# EAGLE design ArduinoRFM95 V6 (EAGLE 7.7.0)
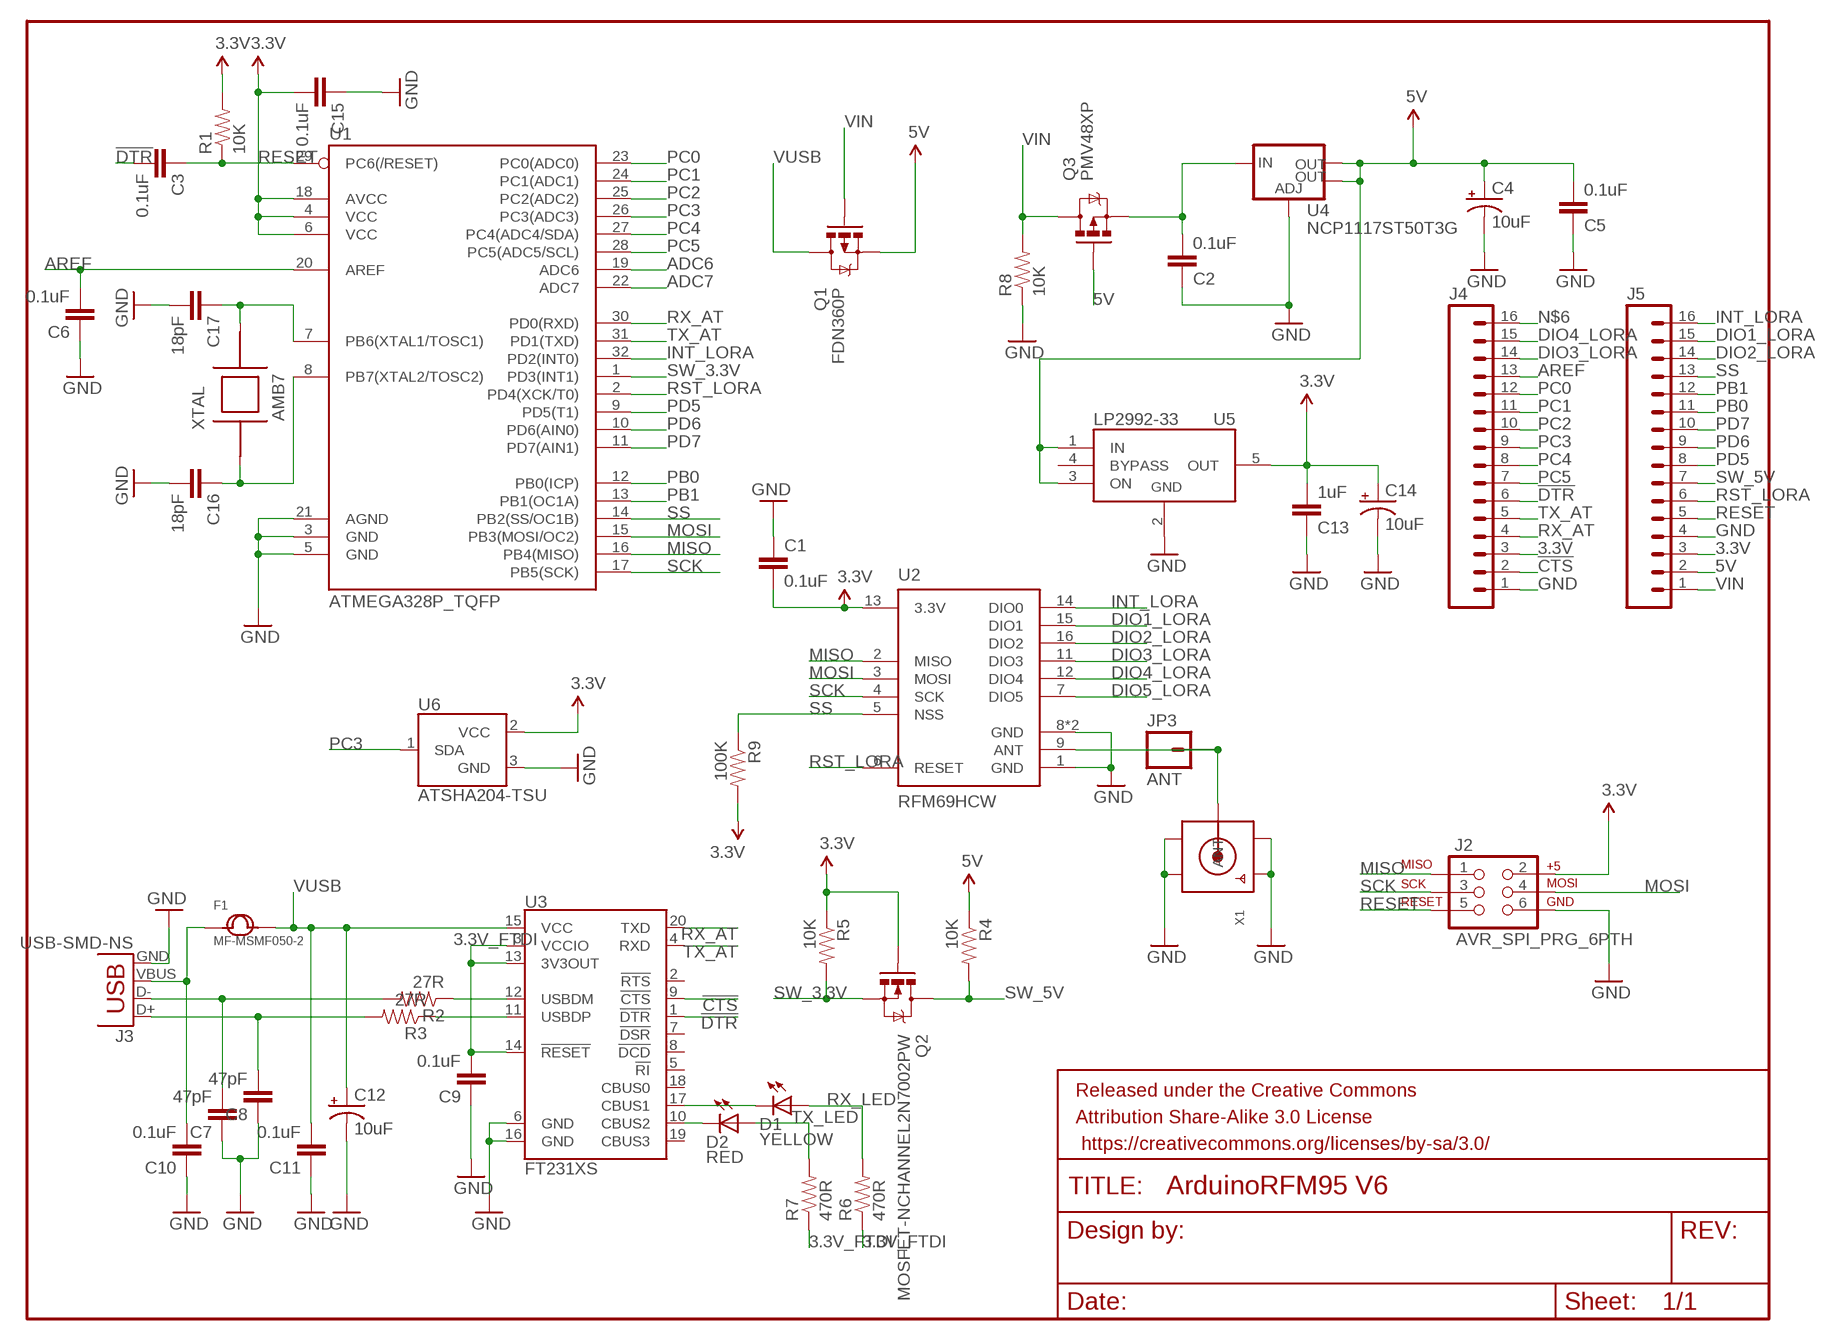
[diagram p0: schematic, sheet 1]

## Parts
C1  0.1uF  CAP0603-CAP  [0603-CAP]
C2  0.1uF  CAP0603-CAP  [0603-CAP]
C3  0.1uF  CAP0603-CAP  [0603-CAP]
C4  10uF  CAP_POL3528-KIT  [EIA3528-KIT]
C5  0.1uF  CAP0603-CAP  [0603-CAP]
C6  0.1uF  CAP0603-CAP  [0603-CAP]
C7  47pF  CAP0603-CAP  [0603-CAP]
C8  47pF  CAP0603-CAP  [0603-CAP]
C9  0.1uF  CAP0603-CAP  [0603-CAP]
C10  0.1uF  CAP0603-CAP  [0603-CAP]
C11  0.1uF  CAP0603-CAP  [0603-CAP]
C12  10uF  CAP_POL3528-KIT  [EIA3528-KIT]
C13  1uF  CAP0603-CAP  [0603-CAP]
C14  10uF  CAP_POL3528-KIT  [EIA3528-KIT]
C15  0.1uF  CAP0603-CAP  [0603-CAP]
C16  18pF  CAP0603-CAP  [0603-CAP]
C17  18pF  CAP0603-CAP  [0603-CAP]
D1  YELLOW  LEDCHIP-LED0603  [CHIP-LED0603]
D2  RED  LEDCHIP-LED0603  [CHIP-LED0603]
F1  MF-MSMF050-2  SMD-PPTC-USE-PPTC-0.50A-15V-0.15OHM(1812)  [F1812]
FRAME1  FRAME-LETTER  [CREATIVE_COMMONS]
J2  AVR_SPI_PRG_6PTH  [2X3]
J3  USB-SMD-NS  [USB-MINIB-NOSTOP]
J4  M161X16_NO_SILK  [1X16_NO_SILK]
J5  M161X16_NO_SILK  [1X16_NO_SILK]
JP3  M01NOSILK-KIT  [1X01NS-KIT]
Q1  FDN360P  MOSFET-PCHANNELSMD  [SOT23-3]
Q2  MOSFET-NCHANNEL2N7002PW  [SOT323]
Q3  PMV48XP  MOSFET-PCHANNELSMD  [SOT23-3]
R1  10K  RESISTOR0603-RES  [0603-RES]
R2  27R  RESISTOR0603-RES  [0603-RES]
R3  27R  RESISTOR0603-RES  [0603-RES]
R4  10K  RESISTOR0603  [0603-RES]
R5  10K  RESISTOR0603-RES  [0603-RES]
R6  470R  RESISTOR0603-RES  [0603-RES]
R7  470R  RESISTOR0603-RES  [0603-RES]
R8  10K  RESISTOR0603-RES  [0603-RES]
R9  100K  RESISTOR0603-RES  [0603-RES]
U1  ATMEGA328P_TQFP  [TQFP32-08]
U2  RFM69HCW  [RFM69HCW-XXXS2]
U3  FT231XS  [SSOP20_L]
U4  NCP1117ST50T3G  V_REG_LM1117SOT223  [SOT223]
U5  LP2992-33  LP2992-3.3  [SOT-23-5]
U6  ATSHA204-TSU  [SOT23-3]
X1  SMACONNECTOR_EDGE_UFL  [SMA_EDGELAUNCH_UFL]
XTAL  AMB7  [2-SMD_ABM7]

## Nets
3.3V: C1.2 C13.2 C14.A(+) C15.2 J2.2 J4.3 J5.3 Q2.1(G) R1.2 R5.1 R9.2 U1.4(VCC) U1.6(VCC) U1.18(AVCC) U2.13(3.3V) U5.5(OUT) U6.2(VCC)
3.3V_FTDI: C9.2 R6.1 R7.1 U3.3(VCCIO) U3.13(3V3OUT) U3.14(!RESET)
5V: C4.A(+) C5.2 J5.2 Q1.2(S) Q3.1(G) R4.1 U4.2(OUT) U4.4(OUT) U5.1(IN) U5.3(ON)
!CTS: J4.2 U3.9(!CTS)
!DTR: C3.2 J4.6 U3.1(!DTR)
ADC6: U1.19(ADC6)
ADC7: U1.22(ADC7)
ANT: JP3.1 U2.9(ANT) X1.P(ANT)
AREF: C6.2 J4.13 U1.20(AREF)
DIO1_LORA: J5.15 U2.15(DIO1)
DIO2_LORA: J5.14 U2.16(DIO2)
DIO3_LORA: J4.14 U2.11(DIO3)
DIO4_LORA: J4.15 U2.12(DIO4)
DIO5_LORA: U2.7(DIO5)
GND: C1.1 C2.1 C4.C(-) C5.1 C6.1 C7.1 C8.1 C9.1 C10.1 C11.1 C12.C(-) C13.1 C14.C(-) C15.1 C16.2 C17.2 J2.6 J3.GND J4.1 J5.4 R8.1 U1.3(GND) U1.5(GND) U1.21(AGND) U2.1(GND) U2.8(GND) U2.10(GND) U3.6(GND) U3.16(GND) U4.1(ADJ) U5.2(GND) U6.3(GND) X1.GND@1(GND1) X1.GND@2(GND2) X1.GND@3(GND3) X1.GND@4(GND4)
INT_LORA: J5.16 U1.32(PD2(INT0)) U2.14(DIO0)
MISO: J2.1 U1.16(PB4(MISO)) U2.2(MISO)
MOSI: J2.4 U1.15(PB3(MOSI/OC2)) U2.3(MOSI)
N$1: R3.1 U3.11(USBDP)
N$2: C7.2 J3.D- R2.2
N$3 [Vin]: C2.2 Q3.2(S) U4.3(IN)
N$4: R2.1 U3.12(USBDM)
N$5: C10.2 F1.1 J3.VBUS
N$6: J4.16
N$7: C17.1 U1.7(PB6(XTAL1/TOSC1)) XTAL.P$2
N$8: D2.C U3.10(CBUS2)
N$9: C16.1 U1.8(PB7(XTAL2/TOSC2)) XTAL.P$1
N$10: C8.2 J3.D+ R3.2
N$11: D1.C U3.17(CBUS1)
PB0: J5.11 U1.12(PB0(ICP))
PB1: J5.12 U1.13(PB1(OC1A))
PC0: J4.12 U1.23(PC0(ADC0))
PC1: J4.11 U1.24(PC1(ADC1))
PC2: J4.10 U1.25(PC2(ADC2))
PC3: J4.9 U1.26(PC3(ADC3)) U6.1(SDA)
PC4: J4.8 U1.27(PC4(ADC4/SDA))
PC5: J4.7 U1.28(PC5(ADC5/SCL))
PD5: J5.8 U1.9(PD5(T1))
PD6: J5.9 U1.10(PD6(AIN0))
PD7: J5.10 U1.11(PD7(AIN1))
RESET: C3.1 J2.5 J5.5 R1.1 U1.29(PC6(/RESET))
RST_LORA: J5.6 U1.2(PD4(XCK/T0)) U2.6(RESET)
RX_AT: J4.4 U1.30(PD0(RXD)) U3.20(TXD)
RX_LED: D1.A R6.2
SCK: J2.3 U1.17(PB5(SCK)) U2.4(SCK)
SS: J5.13 R9.1 U1.14(PB2(SS/OC1B)) U2.5(NSS)
SW_3.3V: Q2.2(S) R5.2 U1.1(PD3(INT1))
SW_5V: J5.7 Q2.3(D) R4.2
TX_AT: J4.5 U1.31(PD1(TXD)) U3.4(RXD)
TX_LED: D2.A R7.2
VIN [Vin]: J5.1 Q1.1(G) Q3.3(D) R8.2
VUSB: C11.2 C12.A(+) F1.2 Q1.3(D) U3.15(VCC)
Unconnected: U3.2(!RTS) U3.5(!RI) U3.7(!DSR) U3.8(!DCD) U3.18(CBUS0) U3.19(CBUS3) U5.4(BYPASS)

## Library data of the parts
C1-C3 C5-C11 C13 C15-C17 = SparkFun-Capacitors:CAP: Capacitor Standard 0603 ceramic capacitor, and 0.1" leaded capacitor.
C4 C12 C14 = SparkFun-Capacitors:CAP_POL: Capacitor Polarized These are standard SMD and PTH capacitors. Normally 10uF, 47uF, and 100uF in electrolytic and tantalum varieties. Always verify the external diameter of the through hole cap, it varies with capacity, voltage, and manufacturer. The EIA devices should be standard.
D1 D2 = adafruit:LED: LED OSRAM: - CHIPLED LG R971, LG N971, LY N971, LG Q971, LY Q971, LO R971, LY R971 LH N974, LH R974 LS Q976, LO Q976, LY Q976 LO Q996 - Hyper CHIPLED LW Q18S LB Q993, LB Q99A, LB R99A - SideLED LS A670, LO A670, LY A670, LG A670, LP A670 LB A673, LV A673, LT A673, LW A673 LH A674 LY A675 LS A676, LA A676, LO A676, LY A676, LW A676 LS A679, LY A679, LG A679 - Hyper Micro SIDELED® LS Y876, LA Y876, LO Y876, LY Y876 LT Y87S - SmartLED LW L88C, LW L88S LB L89C, LB L89S, LG L890 LS L89K, LO L89K, LY L89K LS L896, LA L896, LO L896, LY L896 - TOPLED LS T670, LO T670, LY T670, LG T670, LP T670 LSG T670, LSP T670, LSY T670, LOP T670, LYG T670 LG T671, LOG T671, LSG T671 LB T673, LV T673, LT T673, LW T673 LH T674 LS T676, LA T676, LO T676, LY T676, LB T676, LH T676, LSB T676, LW T676 LB T67C, LV T67C, LT T67C, LS T67K, LO T67K, LY T67K, LW E67C LS E67B, LA E67B, LO E67B, LY E67B, LB E67C, LV E67C, LT E67C LW T67C LS T679, LY T679, LG T679 LS T770, LO T770, LY T770, LG T770, LP T770 LB T773, LV T773, LT T773, LW T773 LH T774 LS E675, LA E675, LY E675, LS T675 LS T776, LA T776, LO T776, LY T776, LB T776 LHGB T686 LT T68C, LB T68C - Hyper Mini TOPLED® LB M676 - Mini TOPLED Santana® LG M470 LS M47K, LO M47K, LY M47K Source: http://www.osram.convergy.de/
F1 = Seeed-OPL-fuse:SMD-PPTC-USE-PPTC-0.50A-15V-0.15OHM(1812): 307010040; MPN: MF-MSMF050-2
FRAME1 = SparkFun-Retired:FRAME-LETTER: Schematic Frame Standard 8.5x11 US Letter frame
J2 = SparkFun-Connectors:AVR_SPI_PRG_6: AVR ISP 6 Pin This is the reduced ISP connector for AVR programming. Common on Arduino. This footprint will take up less PCB space and can be used with a 10-pin to 6-pin adapter such as SKU: BOB-08508 **Special note about "TEST_POINT" package. The stop mask is on the top side, so if you want your programming test points to be on the bottom of your board, make sure to place this package on the bottom side of the board. This also ensure that the orientation to program from the bottom side will be correct.
J3 = SparkFun-Connectors:USB: USB Connectors USB-B-PTH is fully proven SKU : PRT-00139/CONN-08278 USB-miniB is fully proven SKU : PRT-00587 USB-A-PCB is untested. USB-A-H is throughly reviewed, but untested. Spark Fun Electronics SKU : PRT-00437 USB-B-SMT is throughly reviewed, but untested. Needs silkscreen touching up. USB-A-S has not been used/tested USB-MB-H has not been used/tested USB-MICROB has been used. CONN-09505
J4 J5 = SparkFun-Connectors:M16: 1x16 .1" header
JP3 = SparkFun-Connectors:M01: Header 1 Standard 1-pin 0.1" header. Use with straight break away headers (SKU : PRT-00116), right angle break away headers (PRT-00553), swiss pins (PRT-00743), machine pins (PRT-00117), and female headers (PRT-00115). SMTSO-256-ET is a "flush mount" nut for a 4-40 screw. The older package used to be too tight, and did not allow it to sit properly thru the drill hit. The latest (0.165DIA) fits nice and snug.
Q1 Q3 = SparkFun-DiscreteSemi:MOSFET-PCHANNEL: Generic PMOSFET IRLML2244 - TRANS-11153 (SOT-23 -20V -4.3A) (1.Gate 2.Source 3.Drain) FQP27P06 - COM-10349 <http://www.sparkfun.com/products/10349> (TO-220 -60V -27A) (1.Gate 2.Source 3.Drain)
Q2 = SparkFun-DiscreteSemi:MOSFET-NCHANNEL: Common NMOSFET Parts MFG P/N Store ID Prod ID FDD8780 TRANS-09984 SI7820DN TRANS-11055 FDS6630A IC-08089 2N7002PW TRANS-11151 FQP30N06L COM-10213 TRANS-10060 BSS123LT1G TRANS-08345 BSS138 TRANS-00830 BS170 2N7000; PROD_ID: TRANS-11151
R1-R9 = SparkFun-Resistors:RESISTOR: Resistor Basic schematic elements and footprints for 0603, 1206, and PTH resistors.
U1 = SparkFun-DigitalIC:ATMEGA328P_TQFP; PROD_ID: IC-09069
U2 = SparkFun-RF:RFM69H; PROD_ID: IC-11997, IC-12053
U3 = SparkFun-DigitalIC:FT231X: FTDI FT231X Full Speed USB to Full-handshake UART This USB2.0 Full Speed IC offers a compact bridge to full handshake UART interfaces. The device is a UART, capable of operating up to 3MBaud, with low power consumption (8mA). The FT231X includes the complete FT-X series feature set and enables USB to be added into a system design quickly and easily over a UART interface.; PROD_ID: IC-11524
U4 = SparkFun-PowerIC:V_REG_LM1117: Voltage Regulator LM1117 Standard adjustable voltage regulator but in SMD form. Spark Fun Electronics SKU : COM-00595; PROD_ID: VREG-08170
U5 = regulators:LP2992-*: LP2992-x Micropower 250 mA ultra low-dropout regulator in SOT-23-5 package For use with very low ESR output capacitors
U6 = SparkFun-DigitalIC:ATSHA204: Atmel ATSHA204 The Atmel ATSHA204 is an optimized authentication chip that includes a 4.5Kb EEPROM. This array can be used for storage of keys, miscellaneous read/write, read-only, password or secret data, and consumption tracking. Access to the various sections of memory can be restricted in a variety of ways and then the configuration locked to prevent changes.
X1 = adafruit:SMACONNECTOR: SMA Connector 90° DIP SMA Connector, 50 Ohm (4UConnector: 07259)
XTAL = ABM7:AMB7: ABM7 - 16MHz crystal Datasheet: http://www.abracon.com/Resonators/abm7.pdf

## Net classes
0 default: width 0.254 mm, drill 0.61 mm, clearance 0.203 mm
1 Vin: width 0.61 mm, drill 0.61 mm, clearance 0.203 mm

## Board
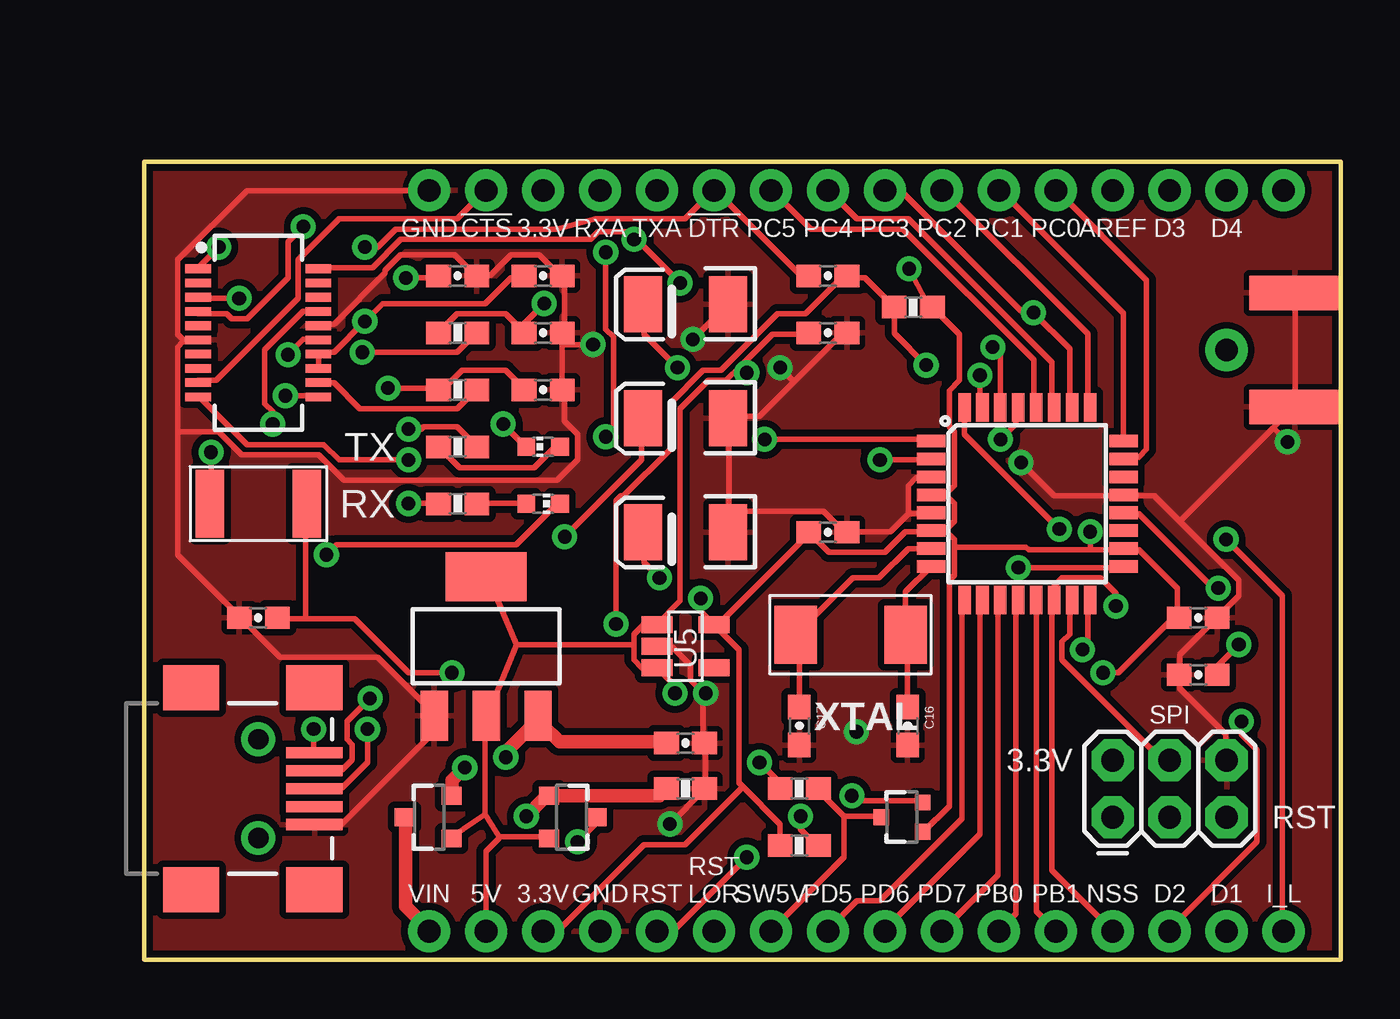
[diagram p1: board, top side]
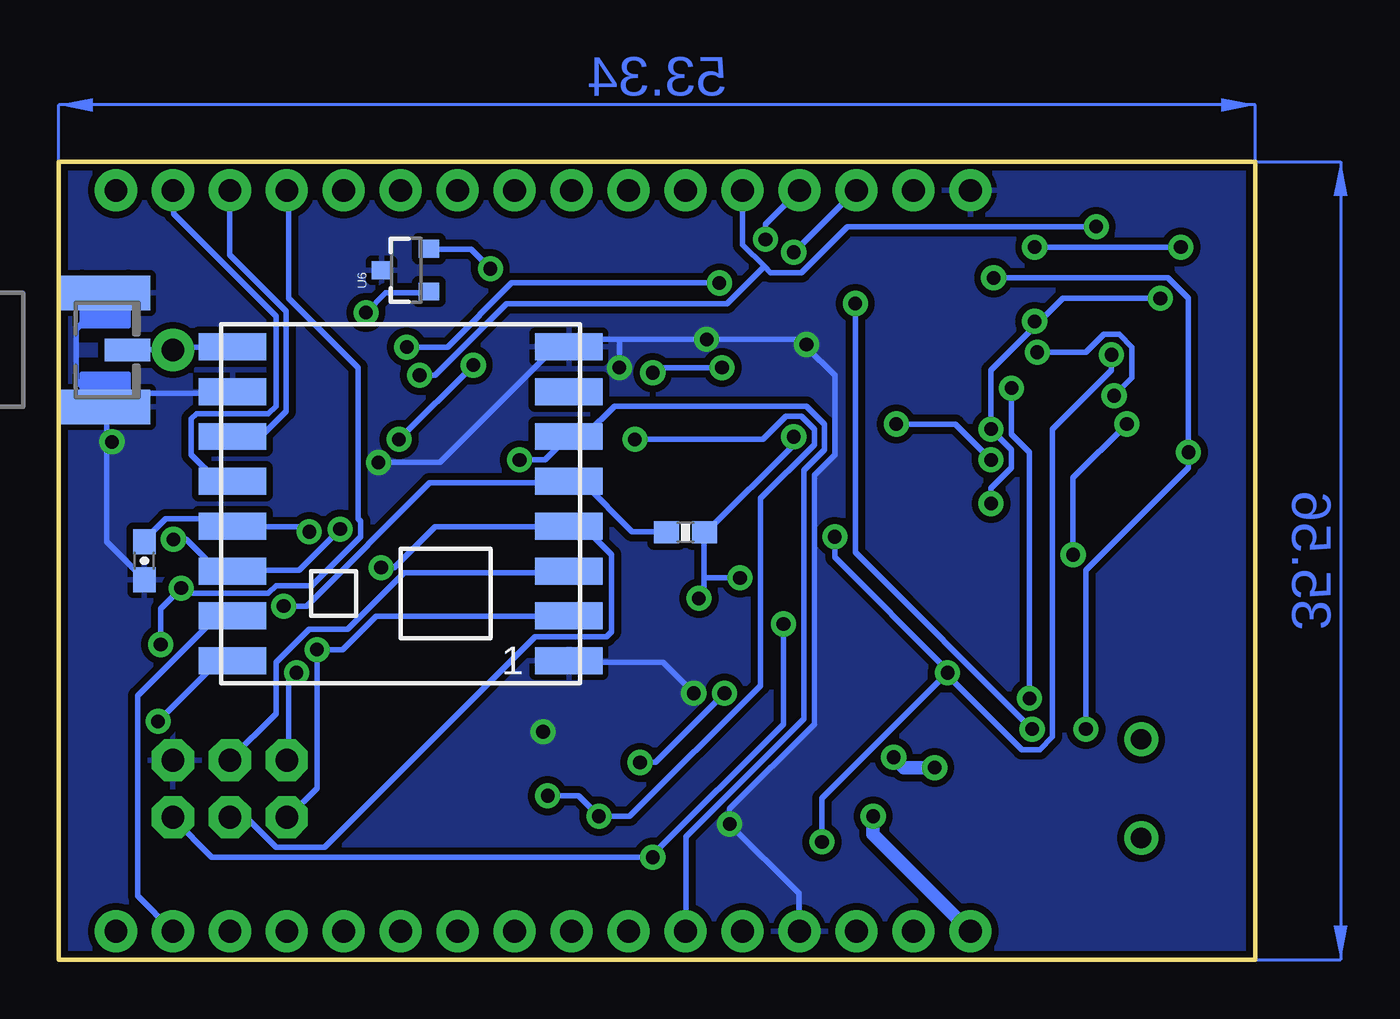
[diagram p2: board, bottom side, seen from below]

Size 53.34 x 35.56 mm. Coordinates in mm from the lower left corner, seen from the top.
Outline: 0,0 0,35.56 53.34,35.56 53.34,0 0,0
Copper layers (1*16): Top 0.035mm / dielectric 1.5mm / Bottom 0.035mm
Design rules "SparkFun": minimum track width 8mil, minimum drill 20mil, track to track 8mil, track to pad 8mil, pad to pad 8mil, via to via 8mil, smd to smd 8mil, copper to edge 8mil, drill to drill 8mil, minimum pad ring 12mil, minimum via ring 10mil, stop-mask expansion 4mil, vias tented up to drill 20mil, thermal gap 10mil

### Footprints (pad centres in the part's own frame; a part is rotated, then mirrored left to right if it is on the bottom)
0603-CAP = smd 1.1 x 1: 1 -0.85,0; 2 0.85,0
EIA3528-KIT = smd 1.7 x 2.5: A 1.9,0; C -1.9,0
CHIP-LED0603 = smd 0.8 x 0.8: A 0,-0.75; C 0,0.75
F1812 = smd 1.27 x 3.048: 1 -2.159,0; 2 2.159,0
2X3 = drill 1.016 pad 1.88 octagon: 1 0,0; 2 0,2.54; 3 2.54,0; 4 2.54,2.54; 5 5.08,0; 6 5.08,2.54
USB-MINIB-NOSTOP = smd 2.5 x 0.5: D+ 2.5,0; D- 2.5,0.8; GND 2.5,-1.6; ID 2.5,-0.8; VBUS 2.5,1.6 | smd 2.5 x 2: G1 -3,-4.5; G2 -3,4.5; G3 2.5,4.5; G4 2.5,-4.5 | drill 0.9 pad 0.8: H1 0,2.2 | drill 0.9 pad 0.787: H2 0,-2.2
1X16_NO_SILK = drill 1.016 pad 1.88: 1 0,0; 2 2.54,0; 3 5.08,0; 4 7.62,0; 5 10.16,0; 6 12.7,0; 7 15.24,0; 8 17.78,0; 9 20.32,0; 10 22.86,0; 11 25.4,0; 12 27.94,0; 13 30.48,0; 14 33.02,0; 15 35.56,0; 16 38.1,0
1X01NS-KIT = drill 1.016 pad 1.88: 1 0,0
SOT23-3 = smd 0.8 x 0.9: 1 -0.95,-1; 2 0.95,-1; 3 0,1.1
SOT323 = smd 0.7 x 0.7: 1 -0.65,-0.925; 2 0.65,-0.925; 3 0,0.925
0603-RES = smd 1.1 x 1: 1 -0.85,0; 2 0.85,0
TQFP32-08 = smd 1.27 x 0.559: 1 -4.293,2.8; 2 -4.293,2; 3 -4.293,1.2; 4 -4.293,0.4; 5 -4.293,-0.4; 6 -4.293,-1.2; 7 -4.293,-2; 8 -4.293,-2.8; 17 4.293,-2.8; 18 4.293,-2; 19 4.293,-1.2; 20 4.293,-0.4; 21 4.293,0.4; 22 4.293,1.2; 23 4.293,2; 24 4.293,2.8 | smd 0.559 x 1.27: 9 -2.8,-4.293; 10 -2,-4.293; 11 -1.2,-4.293; 12 -0.4,-4.293; 13 0.4,-4.293; 14 1.2,-4.293; 15 2,-4.293; 16 2.8,-4.293; 25 2.8,4.293; 26 2,4.293; 27 1.2,4.293; 28 0.4,4.293; 29 -0.4,4.293; 30 -1.2,4.293; 31 -2,4.293; 32 -2.8,4.293
RFM69HCW-XXXS2 = smd 3 x 1.2: 1 -7.5,7; 2 -7.5,5; 3 -7.5,3; 4 -7.5,1; 5 -7.5,-1; 6 -7.5,-3; 7 -7.5,-5; 8 -7.5,-7; 9 7.5,-7; 10 7.5,-5; 11 7.5,-3; 12 7.5,-1; 13 7.5,1; 14 7.5,3; 15 7.5,5; 16 7.5,7
SSOP20_L = smd 0.381 x 1.143: 1 -2.857,-2.68; 2 -2.223,-2.68; 3 -1.587,-2.68; 4 -0.953,-2.68; 5 -0.318,-2.68; 6 0.318,-2.68; 7 0.953,-2.68; 8 1.587,-2.68; 9 2.223,-2.68; 10 2.857,-2.68; 11 2.857,2.68; 12 2.223,2.68; 13 1.587,2.68; 14 0.953,2.68; 15 0.318,2.68; 16 -0.318,2.68; 17 -0.953,2.68; 18 -1.587,2.68; 19 -2.223,2.68; 20 -2.857,2.68
SOT223 = smd 1.219 x 2.235: 1 -2.311,-3.099; 2 0,-3.099; 3 2.311,-3.099 | smd 3.6 x 2.2: 4 0,3.099
SOT-23-5 = smd 0.762 x 1.397: 1 -0.953,-1.27; 2 0,-1.27; 3 0.953,-1.27; 4 0.953,1.27; 5 -0.953,1.27
SMA_EDGELAUNCH_UFL = smd 4.064 x 1.524: GND@1 2.032,-2.54; GND@2 2.032,2.54 | smd 4.064 x 1.524 bottom: GND@3 2.032,2.54; GND@4 2.032,-2.54 | smd 2.032 x 1.016: P 3.048,0
2-SMD_ABM7 = smd 1.9 x 2.6: P$1 -2.45,0; P$2 2.45,0

### Placement (x,y rotation side)
C1  49.53,17.78 90 bottom
C2  24.13,9.65 180 top
C3  30.48,30.48 180 top
C4  24.13,29.21 180 top
C5  30.48,27.94 180 top
C6  46.99,12.7 0 top
C7  17.78,25.4 180 top
C8  17.78,27.94 180 top
C9  17.78,30.48 180 top
C10  13.97,30.48 180 top
C11  5.08,15.24 0 top
C12  24.13,24.13 180 top
C13  30.48,19.05 180 top
C14  24.13,19.05 180 top
C15  46.99,15.24 180 top
C16  34.04,10.41 270 top
C17  29.21,10.41 270 top
D1  17.78,20.32 270 top
D2  17.78,22.86 90 top
F1  5.08,20.32 0 top
FRAME1  3.81,43.18 0 top  (outside the outline)
J2  43.18,6.35 0 top
J3  5.08,7.62 0 top
J4  12.7,34.29 0 top
J5  12.7,1.27 0 top
JP3  48.26,27.18 0 top
Q1  19.05,6.35 270 top
Q2  33.78,6.35 90 top
Q3  12.7,6.35 90 top
R1  34.29,29.08 0 top
R2  13.97,25.4 180 top
R3  13.97,27.94 180 top
R4  29.21,7.62 0 top
R5  29.21,5.08 0 top
R6  13.97,20.32 0 top
R7  13.97,22.86 180 top
R8  24.13,7.62 180 top
R9  25.4,19.05 0 bottom
U1  39.37,20.32 0 top
U2  38.1,20.32 180 bottom
U3  5.08,27.94 270 top
U4  15.24,13.97 0 top
U5  24.13,13.97 270 top
U6  37.85,30.73 90 bottom
X1  53.34,27.18 0 bottom
XTAL  31.5,14.48 180 top

### Tracks (layer width: path | path; a pad name or v marks a point on that pad's centre or on a via)
3.3V  (via drill 0.61)
  Top 0.254: 35.78,20.79 36.12,21.13 36.12,23.53 35.89,23.76 35.89,25.36 36.35,25.82 36.35,27.88 R1.2 35.09,29.15 34.86,29.38 v34.1,30.8 | 35.78,20.79 35.09,20.79 U1.4 | 36.12,18.39 36.12,18.73 35.78,19.07 | 36.12,18.39 36.12,17.13 35.89,16.9 35.89,6.84 34.75,5.7 Q2.1 | 35.78,19.07 35.09,19.07 U1.6 34.98,19.07 33.95,19.07 33.03,18.16 30.52,18.16 29.72,18.96 C13.2 29.6,18.96 25.49,14.85 | 42.18,18.27 39.43,18.27 39.32,18.39 36.12,18.39 | 42.18,18.27 43.55,18.27 U1.18 43.66,18.27 44.35,18.27 46.06,16.56 46.06,15.3 C15.2 45.95,15.3 43.43,12.79 v42.75,12.79 | 42.18,18.27 v42.18,19.07 | 35.78,20.79 35.78,20.68 36.12,20.33 36.12,19.53 35.78,19.19 35.78,19.07 | 26.69,7.7 26.52,7.87 26.52,13.82 25.49,14.85 | 26.69,7.7 28.35,6.04 28.35,5.13 R5.1 | v24.8,16.1 24.8,15.53 25.38,14.96 U5.5 25.49,14.85 | v22.97,17.02 22.29,17.7 22.29,18.96 C14.A | 26.69,7.7 24.12,5.13 22.29,5.13 18.52,1.36 17.83,1.36 J5.3 | v20.57,31.53 20.57,28.11 20.92,27.76 20.92,23.65 v20.57,23.3
  Bottom 0.254: C1.2 49.49,18.73 48.58,19.65 45.83,19.65 45.61,19.42 U2.13 45.49,19.3 42.41,19.3 v42.18,19.07 42.29,19.32 | v42.75,12.79 43.09,12.45 43.09,8.9 J2.2 | 24.57,17.02 24.57,16.33 v24.8,16.1 | 24.57,17.02 24.57,18.96 R9.2 24.46,19.07 20.57,22.96 v20.57,23.3 | 24.57,17.02 v22.97,17.02 | v20.57,31.53 17.83,34.28 J4.3 | U6.2 36.8,31.66 34.96,31.66 v34.1,30.8
3.3V_FTDI  (via drill 0.61)
  Top 0.254: C9.2 16.92,30.39 16.34,30.39 15.2,29.25 10.63,29.25 v9.83,28.45 8.46,27.08 7.77,27.08 U3.14 7.77,26.96 7.77,26.39 U3.13 | v11.77,20.33 13.03,20.33 R6.1 | v11.77,23.65 12.34,23.65 12.46,23.76 13.95,23.76 14.74,22.96 R7.1 | v4.23,29.48 2.4,29.48 U3.3
  Bottom 0.254: v11.77,20.33 11.77,21.02 10.86,21.93 10.86,22.73 v11.77,23.65 11.77,26.28 9.66,28.39 | v4.23,29.48 8.57,29.48 9.66,28.39 | v9.83,28.45 9.72,28.45 9.66,28.39
5V  (via drill 0.61)
  Top 0.254: 15.82,5.47 17.95,5.47 Q1.2 | 15.82,5.47 15.2,6.49 | 15.2,6.49 13.72,5.47 Q3.1 | 15.2,6.49 15.2,10.85 U4.2 15.32,10.96 16.59,14.05 | 16.59,14.05 15.32,17.02 U4.4 | 15.32,1.36 J5.2 15.24,4.83 15.82,5.41 15.82,5.47 | v27.43,8.79 28.35,7.87 28.35,7.64 R4.1 | v23.66,11.87 23.66,12.22 U5.3 22.17,13.02 21.83,13.36 21.83,14.05 | 26.57,26.45 25.95,25.82 25.15,25.82 23.89,24.56 23.89,15.99 22.86,14.96 U5.1 22.75,14.96 22.29,14.96 21.83,14.5 21.83,14.05 | 26.57,26.45 28,27.88 29.6,27.88 C5.2 | v23.77,26.39 22.29,27.88 22.29,29.13 C4.A | 26.57,26.45 v26.86,26.16 | 21.83,14.05 16.59,14.05
  Bottom 0.254: v27.43,8.79 26.75,8.79 v23.66,11.87 | v23.77,26.39 26.63,26.39 v26.86,26.16
!CTS
  Top 0.254: U3.9 2.4,25.82 3.2,25.82 6.86,29.48 6.86,31.19 8.69,33.02 13.95,33.02 15.2,34.28 J4.2
!DTR  (via drill 0.61)
  Top 0.254: C3.2 29.6,30.5 29.26,30.5 25.49,34.28 J4.6 25.38,34.28 24.12,33.02 20.12,33.02 18.39,32.56 11.2,32.56 10.4,31.76 v9.83,31.76 | v3.31,31.76 2.4,30.85 U3.1
  Bottom 0.254: v9.83,31.76 v3.31,31.76
ANT
  Bottom 0.254: X1.P 48.35,27.19 JP3.1 48.35,27.3 45.61,27.3 U2.9
AREF  (via drill 0.61)
  Top 0.254: v48.81,14.05 47.89,13.13 47.89,12.79 C6.2 | v47.89,16.56 47.66,16.56 44.35,19.88 43.66,19.88 U1.20
  Bottom 0.254: v48.81,14.05 48.81,15.65 v47.89,16.56 47.78,16.56 47.55,16.33 44.01,16.33 43.66,16.68 42.06,16.68 39.89,18.85 39.89,19.53 40.01,19.65 40.01,26.39 43.09,29.48 43.09,34.28 J4.13
DIO1_LORA
  Bottom 0.254: J5.15 49.84,2.85 49.84,11.76 46.29,15.3 45.61,15.3 U2.15
DIO2_LORA  (via drill 0.61)
  Top 0.254: v48.92,10.62 48.92,10.05 49.61,9.36 49.61,5.25 45.72,1.36 J5.14
  Bottom 0.254: v48.92,10.62 46.29,13.25 45.61,13.25 U2.16
DIO3_LORA
  Bottom 0.254: J4.14 45.72,31.42 43.2,28.91 43.2,24.45 44.23,23.42 45.49,23.42 U2.11
DIO4_LORA
  Bottom 0.254: U2.12 45.61,21.36 46.29,21.36 47.43,22.5 47.43,24.11 47.21,24.33 44.01,24.33 43.66,24.68 43.66,28.68 48.23,33.25 48.23,34.28 J4.15
GND  (via drill 0.61)
  Top 0.254: X1.GND@2 51.32,29.7 51.32,24.68 X1.GND@1 51.21,24.56 50.35,23.7 | 46.18,19.53 48.81,16.9 48.81,16.22 47.89,15.3 C15.1 47.78,15.19 46.18,13.59 46.18,12.79 C6.1 46.18,12.68 46.18,12.1 48.23,10.05 48.23,8.9 J2.6 | 46.18,19.53 45.03,20.68 43.66,20.68 U1.21 43.55,20.68 40.58,20.68 v39.09,22.16 | 46.18,19.53 50.35,23.7 | 50.35,23.7 v50.98,23.08 | 24.92,11.87 24.35,12.45 24.35,13.13 23.55,13.93 22.86,13.93 U5.2 | 24.92,11.87 24.92,9.7 C2.1 25.03,9.59 25.03,7.64 R8.1 24.92,7.53 v23.43,6.04 | v25.03,11.87 24.92,11.87 | v24.46,27.65 25.95,29.13 C4.C | 34.06,19.88 33.26,19.07 31.43,19.07 C13.1 31.2,19.07 30.29,19.99 26.18,19.99 C14.C 26.06,19.07 26.06,24.11 C12.C 26.06,24.22 27.43,24.22 28.98,25.76 | 34.06,19.88 34.98,19.88 U1.5 | 34.06,19.88 34.06,21.13 34.4,21.48 34.98,21.48 U1.3 | 28.98,25.76 31.09,27.88 31.32,27.88 C5.1 | 28.98,25.76 v28.35,26.39 | 18.63,27.42 18.63,27.88 C8.1 18.75,27.99 18.75,30.5 C9.1 18.52,30.5 17.6,31.42 16.34,31.42 15.43,30.5 14.86,30.5 C10.1 14.74,30.5 13.83,31.42 11.43,31.42 10.74,30.73 10.74,30.62 8.46,28.33 7.77,28.33 U3.16 | 18.63,27.42 18.63,25.48 C7.1 18.75,25.36 18.75,23.99 19.32,23.42 19.32,22.28 18.4,21.36 8.91,21.36 7.77,22.5 4.34,22.5 3.31,23.53 1.49,23.53 | 1.71,27.53 2.4,27.53 U3.6 | 1.71,27.53 1.49,27.3 1.49,23.53 | 1.49,23.53 1.49,18.05 4.23,15.3 C11.1 4.34,15.19 6.06,13.47 10.4,13.47 12.92,10.96 U4.1 12.92,10.85 12.92,10.16 8.8,6.04 7.66,6.04 J3.GND | J4.1 12.69,34.28 4.57,34.28 1.49,31.19 1.49,27.88 1.71,27.65 1.71,27.53 | 18.63,27.42 v20,27.42
  Bottom 0.254: 51.21,23.08 51.21,24.56 X1.GND@1 | 51.21,23.08 51.21,18.62 49.61,17.02 C1.1 | U2.10 45.61,25.25 50.41,25.25 51.09,24.56 X1.GND@1 | X1.GND@2 51.32,29.7 51.32,29.36 52.58,28.11 52.58,25.82 51.44,24.68 X1.GND@1 | v50.98,23.08 51.21,23.08 | v25.03,11.87 26.4,13.25 30.52,13.25 U2.1 | J5.4 20.34,1.36 20.34,2.96 v23.43,6.04 23.43,6.73 19.66,10.5 19.66,21.59 18.75,22.5 18.75,26.05 20,27.3 v20,27.42 20.23,27.65 v24.46,27.65 28.35,27.65 | 28.35,27.65 30.29,27.65 30.52,27.42 U2.8 30.63,27.19 31.32,27.19 36.35,22.16 v39.09,22.16 | v28.35,26.39 28.35,27.65
  other vias: 31.75,10.16
  pour Bottom (isolate 0.305): 0,35.56 53.34,35.56 53.34,0 0,0
  pour Top (isolate 0.305): 0,35.56 53.34,35.56 53.34,0 0,0
INT_LORA  (via drill 0.61)
  Top 0.254: v40.8,19.19 36.58,23.42 36.58,24.56 U1.32 | v48.23,18.73 50.75,16.22 50.75,1.36 J5.16
  Bottom 0.254: v40.8,19.19 42.63,17.36 45.49,17.36 U2.14 45.72,17.36 46.29,17.36 47.66,18.73 v48.23,18.73
MISO  (via drill 0.61)
  Top 0.254: v41.83,13.82 42.06,14.05 42.06,15.99 U1.16
  Bottom 0.254: J2.1 43.09,6.39 41.83,7.64 v41.83,13.82 40.69,13.82 39.2,15.3 30.63,15.3 U2.2
MOSI
  Top 0.254: U1.15 41.26,15.99 41.26,14.5 40.92,14.16 40.92,13.36 45.38,8.9 45.72,8.9 J2.4
  Bottom 0.254: U2.3 30.63,17.25 37.95,17.25 40.46,14.73 42.18,14.73 43.66,13.25 43.66,10.96 45.72,8.9 J2.4
N$1  (via drill 0.61)
  Top 0.254: v9.72,27.08 13.95,27.08 14.74,27.88 R3.1 | v6.29,25.13 7.66,25.13 U3.11
  Bottom 0.254: v9.72,27.08 7.54,27.08 6.74,27.88 6.06,27.88 5.49,27.3 5.49,25.93 v6.29,25.13
N$2  (via drill 0.61)
  Top 0.254: C7.2 16.92,25.48 16.12,26.28 14.17,26.28 13.37,25.48 13.14,25.48 R2.2 13.03,25.48 v10.86,25.48 | v10.06,11.65 9.03,10.62 9.03,9.82 9.26,9.59 9.26,8.9 8.8,8.45 7.66,8.45 J3.D-
  Bottom 0.254: v10.86,25.48 10.86,23.42 10.06,22.62 v10.06,11.65
N$3  (via drill 0.61)
  Top 0.61: v14.29,8.56 13.72,7.99 13.72,7.3 Q3.2 | v16.12,9.02 16.12,9.25 17.49,10.62 17.49,10.85 U4.3 17.72,10.5 18.52,9.7 23.2,9.7 C2.2
  Bottom 0.61: v14.29,8.56 15.66,8.56 v16.12,9.02
N$4
  Top 0.254: R2.1 14.74,25.36 13.95,24.56 9.6,24.56 8.46,25.7 7.77,25.7 U3.12
N$5  (via drill 0.61)
  Top 0.254: v11.66,30.39 13.03,30.39 C10.2 | v2.97,22.62 2.97,20.33 F1.1 | v7.54,10.27 7.54,9.25 J3.VBUS
  Bottom 0.254: v11.66,30.39 3.89,30.39 2.97,29.48 v2.97,22.62 2.97,21.93 7.54,17.36 v7.54,10.27
N$7
  Top 0.254: U1.7 34.07,18.32 32.77,17.02 31.59,17.02 XTAL.P$2 29.21,14.31 C17.1
N$8  (via drill 0.61)
  Top 0.254: v16,23.88 16.92,22.96 D2.C | v11.77,22.28 8.69,22.28 8,22.96 4.57,22.96 2.4,25.13 U3.10
  Bottom 0.254: v16,23.88 13.37,23.88 v11.77,22.28
N$9
  Top 0.254: U1.8 33.95,16.39 XTAL.P$1 34.04,14.39 C16.1
N$10  (via drill 0.61)
  Top 0.254: R3.2 13.14,27.99 13.95,28.79 16.12,28.79 16.92,27.99 C8.2 16.8,28.22 v17.83,29.25 | v9.94,10.27 9.94,8.79 8.8,7.64 7.66,7.64 J3.D+
  Bottom 0.254: v17.83,29.25 17.83,18.16 v9.94,10.27
N$11  (via drill 0.61)
  Top 0.254: v8.12,18.05 8.57,18.5 16.57,18.5 18.29,20.22 18.52,20.22 D1.C | v5.71,23.88 5.71,24.45 5.37,24.79 5.37,27.19 7.09,28.91 7.66,28.91 U3.17
  Bottom 0.254: v8.12,18.05 8.12,21.48 v5.71,23.88
PB0
  Top 0.254: U1.12 38.86,15.99 38.86,2.04 38.18,1.36 J5.11
PB1
  Top 0.254: U1.13 39.78,15.99 39.78,2.16 40.58,1.36 J5.12
PC0
  Top 0.254: U1.23 43.66,22.4 44.35,22.4 44.69,22.75 44.69,30.29 40.69,34.29 J4.12
PC1
  Top 0.254: U1.24 43.66,28.8 38.18,34.29 J4.11
PC2
  Top 0.254: U1.25 42.06,24.69 42.06,27.89 35.66,34.29 J4.10
PC3  (via drill 0.61)
  Top 0.254: U1.26 41.26,24.69 41.26,27.23 v39.65,28.84 39.55,28.92 39.09,28.92 33.72,34.29 J4.9
  Bottom 0.254: U6.1 36.92,29.72 38.77,29.72 v39.65,28.84
PC4
  Top 0.254: U1.27 40.46,24.68 40.46,26.62 34.06,33.02 31.77,33.02 30.52,34.28 J4.8
PC5
  Top 0.254: U1.28 39.66,24.68 39.66,26.73 33.83,32.56 29.72,32.56 28,34.28 J4.7
PD5
  Top 0.254: U1.9 36.46,15.99 36.46,6.27 32.8,2.62 31.77,2.62 30.52,1.36 J5.8
PD6
  Top 0.254: U1.10 37.26,15.99 37.26,5.59 33.03,1.36 J5.9
PD7
  Top 0.254: U1.11 38.06,15.99 38.06,3.76 35.66,1.36 J5.10
RESET  (via drill 0.61)
  Top 0.254: v38.18,23.19 38.86,23.88 38.86,24.56 U1.29 | J5.5 22.86,1.36 23.66,1.36 v26.86,4.56 | v21.03,14.96 21.03,20.45 21.26,20.68 21.37,20.68 23.43,22.73 23.43,24.79 24.92,26.28 25.72,26.28 28.23,28.79 29.49,28.79 31.2,30.5 C3.1 31.43,30.39 32.13,30.39 R1.1 33.44,27.93 v34.86,26.5
  Bottom 0.254: v34.86,26.5 v38.18,23.19 | J2.5 48.23,6.27 46.52,4.56 v26.86,4.56 26.86,4.67 21.03,10.5 v21.03,14.96
RST_LORA  (via drill 0.61)
  Top 0.254: v32.8,22.28 34.98,22.28 U1.2
  Bottom 0.254: v32.8,22.28 31.66,22.28 30.63,23.3 U2.6 30.52,23.42 29.83,23.42 28.57,24.68 20,24.68 19.2,23.88 19.2,22.73 20.12,21.82 20.12,10.73 25.38,5.47 25.38,1.36 J5.6
RX_AT  (via drill 0.61)
  Top 0.254: U3.20 7.77,30.85 10.17,30.85 11.43,32.11 19.89,32.11 20.23,32.45 21.49,32.45 v21.83,32.11 21.95,32.11 v23.89,30.16 | v37.83,27.3 38.18,26.96 38.18,24.68 U1.30
  Bottom 0.254: v21.83,32.11 21.83,32.79 20.34,34.28 J4.4 | v37.83,27.3 36.01,27.3 33.15,30.16 v23.89,30.16
RX_LED
  Top 0.254: D1.A 16.92,20.33 14.86,20.33 R6.2
SCK  (via drill 0.61)
  Top 0.254: v38.98,17.48 43.66,17.48 U1.17
  Bottom 0.254: v38.98,17.48 38.41,17.48 36.58,19.3 30.63,19.3 U2.4 30.52,19.3 29.95,19.3 28.69,18.05 28.69,14.62 28.92,14.39 32.12,14.39 41.49,5.02 43.66,5.02 44.92,6.27 45.72,6.27 J2.3
SS  (via drill 0.61)
  Top 0.254: J5.13 40.46,3.99 40.46,15.99 U1.14 40.58,16.1 40.58,16.68 40.92,17.02 42.63,17.02 43.32,16.33 v43.32,15.76
  Bottom 0.254: R9.1 26.29,19.07 27.77,19.07 29.95,21.25 30.52,21.25 U2.5 30.63,21.25 36.8,21.25 42.29,15.76 v43.32,15.76
SW_3.3V  (via drill 0.61)
  Top 0.254: v31.55,7.3 31.77,7.07 34.63,7.07 Q2.2 | v29.26,6.39 29.26,5.82 29.95,5.13 R5.2 | v27.66,23.19 34.98,23.19 U1.1
  Bottom 0.254: v31.55,7.3 30.18,7.3 v29.26,6.39 27.89,6.39 22.06,12.22 22.06,20.56 19.66,22.96 19.66,23.65 20.23,24.22 20.92,24.22 21.95,23.19 v27.66,23.19
SW_5V
  Top 0.254: 31.2,6.39 32.8,6.39 Q2.3 | 31.2,6.39 30.06,7.53 R4.2 | 31.2,6.39 31.2,4.56 28,1.36 J5.7
TX_AT  (via drill 0.61)
  Top 0.254: v7.09,32.68 6.4,31.99 6.4,30.39 4.57,28.56 3.89,28.56 3.66,28.79 2.4,28.79 U3.4 | v37.26,26.05 37.26,24.68 U1.31
  Bottom 0.254: v7.09,32.68 18.17,32.68 20.23,30.62 21.6,30.62 21.89,30.91 | 21.89,30.91 22.86,31.88 J4.5 | v37.26,26.05 36.58,26.05 33.38,29.25 23.55,29.25 21.89,30.91
TX_LED
  Top 0.254: D2.A 18.52,22.85 18.29,22.85 17.37,21.93 14.06,21.93 13.14,22.85 R7.2
VIN  (via drill 0.61)
  Top 0.61: R8.2 23.2,7.53 22.97,7.3 Q1.1 17.83,7.19 v17.03,6.39 | Q3.3 11.66,6.27 11.66,2.39 12.69,1.36 J5.1
  Bottom 0.61: v17.03,6.39 17.03,5.59 12.8,1.36 J5.1
VUSB  (via drill 0.61)
  Top 0.254: v19.32,5.25 20.12,6.04 20.12,6.27 Q1.3 | v13.72,12.79 11.77,12.79 9.37,15.19 7.2,15.19 | 7.2,15.19 5.94,15.19 C11.2 | v6.4,26.96 7.09,27.65 7.66,27.65 U3.15 | v18.75,18.85 22.17,22.28 22.17,24.11 C12.A | 7.2,15.19 7.2,20.22 F1.2
  Bottom 0.254: v19.32,5.25 19.32,7.19 v13.72,12.79 | v6.4,26.96 6.4,26.28 9.03,23.65 9.03,9.93 9.6,9.36 10.4,9.36 13.72,12.68 v13.72,12.79 | v18.75,18.85 18.75,17.93 13.72,12.9 v13.72,12.79
(copper drawn outside any net)
  shapes: Bottom area x2

### Text on the board
tPlace: GND | !CTS | 3.3V | RXA | TXA | !DTR | PC5 | PC4 | PC3 | PC2 | PC1 | PC0 | AREF | D3 | D4 | TX | RX | SPI | 3.3V | RST | VIN | 5V | 3.3V | GND | RST | RST / LOR | SW5V | PD5 | PD6 | PD7 | PB0 | PB1 | NSS | D2 | D1 | I_L